# Altium project TEBF0808.PrjPCB (part 6 of 6)
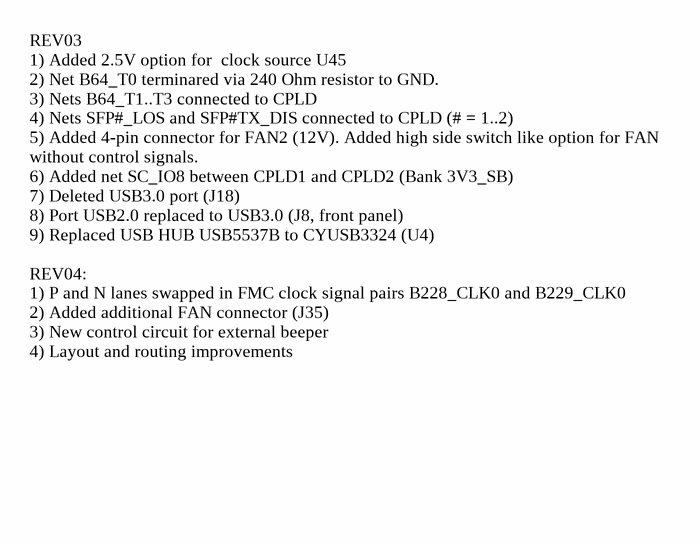
[diagram p36: Revision_Changes.SchDoc]

## Nets that join several sheets
1.2V: USB (20 pins), Power_3 (6 pins)
1.8V: USB-PHY (5 pins), ETH-PHY (9 pins), I2C_system (13 pins), CLK (L18.1), SD (C43.1 U15.5), SC (U17.37 U17.51 U17.66), SC2 (6 pins), XMOD (J12.6), J2 (D16.1), J3 (J3.43 J3.44), Audio (5 pins), eMMC (20 pins), Power_3 (11 pins)
3.3V_MOD: Power_1 (7 pins), J1 (5 pins), J2 (12 pins), J3 (5 pins)
3.3V_PCI: PCIe (6 pins), SFP (24 pins), Power_1 (7 pins)
3.3V_PER: TEBF0808 (R29.2), SFP (5 pins), DP_PS (C193.1 R38.1 R158.1 U40.8), USB-CONN (8 pins), USB (13 pins), USB-PHY (C21.1 L4.1 U9.20 U9.21), ETH-PHY (5 pins), I2C_system (R63.1 R132.1), CLK (L10.2 R130.1 R131.1), SD (6 pins), SC (U32.14), SC2 (5 pins), USB3-HUB (7 pins), FMC PWR (5 pins), MISC (12 pins), eMMC (9 pins), FireFly (16 pins), Power_3 (13 pins), CLK_MUX (6 pins), FMC_MISC (5 pins), PMODE (11 pins)
3V3SB: TEBF0808 (R109.1 R199.2), SC (17 pins), SC2 (15 pins), XMOD (J12.5 J28.5 J28.6 J30.1), Power_2 (R81.1 R183.1), Power_4 (6 pins)
5V: TEBF0808 (J10.9), DP_PS (U31.1 U31.2 U31.4), USB-CONN (C39.1 C82.1 U14.7 U21.7), USB-PHY (R65.1), USB3-HUB (R80.1 R83.2), Power_2 (13 pins), FMC PWR (Q3.4 R205.2), Audio (5 pins), MISC (J29.5), Power_3 (5 pins), Power_4 (D13.2)
12V: TEBF0808 (8 pins), PCIe (5 pins), Power_1 (8 pins), Power_2 (5 pins), FMC PWR (J5.C35 J5.C37), Power_3 (C174.2 C184.2 C186.1 U29.1)
FMC_VADJ: SC (U32.13), J1 (J1.90 J1.120), J3 (J3.15 J3.16), J4 (J4.58 J4.69 J4.105 J4.106), Power_2 (10 pins), FMC PWR (J5.E39 J5.F40 J5.G39 J5.H40), PMODE (U33.14)
GND: TEBF0808 (27 pins), PCIe (68 pins), SFP (31 pins), DP_PS (25 pins), USB-CONN (27 pins), USB (25 pins), USB-PHY (10 pins), ETH-PHY (24 pins), I2C_system (8 pins), CLK (20 pins), SD (20 pins), SC (21 pins), SC2 (20 pins), XMOD (13 pins), Power_1 (26 pins), J1 (50 pins), J2 (48 pins), J3 (30 pins), J4 (45 pins), USB3-HUB (15 pins), Power_2 (26 pins), FMC PWR (168 pins), Audio (29 pins), MISC (28 pins), eMMC (19 pins), FireFly (49 pins), Power_3 (33 pins), Power_4 (8 pins), CLK_MUX (11 pins), FMC_MISC (J5.C34 J5.D35 R125.1), PMODE (8 pins), SATA (5 pins)
1.8V_EN: SC2 (U39.106), Power_3 (R164.2 U19.27)
5V_EN: SC2 (U39.115), Power_2 (D15.1)
5VSBIN: TEBF0808 (J20.9), Power_4 (D12.2)
A_I2C_SCL: I2C_system (U27.4), Audio (R5.1 U3.32)
A_I2C_SDA: I2C_system (U27.3), Audio (R4.1 U3.31)
ADC_SDATA: J3 (J3.55), Audio (U3.26)
B47_L5_N: J3 (J3.54), CLK_MUX (R180.2 U45.4)
B47_L5_P: J3 (J3.56), CLK_MUX (R180.1 U45.5)
B48_L1_N: J3 (J3.17), FMC (J5.F31)
B48_L1_P: J3 (J3.19), FMC (J5.F32)
B48_L2_N: J3 (J3.21), FMC (J5.K35)
B48_L2_P: J3 (J3.23), FMC (J5.K34)
B48_L3_N: J3 (J3.7), FMC (J5.J34)
B48_L3_P: J3 (J3.9), FMC (J5.J33)
B48_L4_N: J3 (J3.11), FMC (J5.E34)
B48_L4_P: J3 (J3.13), FMC (J5.E33)
B48_L5_N: J3 (J3.25), FMC (J5.E31)
B48_L5_P: J3 (J3.27), FMC (J5.E30)
B48_L6_N: J3 (J3.3), FMC_MISC (J5.G3)
B48_L6_P: J3 (J3.5), FMC_MISC (J5.G2)
B48_L8_N: J3 (J3.4), FMC (J5.K38)
B48_L8_P: J3 (J3.6), FMC (J5.K37)
B48_L9_N: J3 (J3.8), FMC (J5.F35)
B48_L9_P: J3 (J3.10), FMC (J5.F34)
B48_L10_N: J3 (J3.22), FMC (J5.E37)
B48_L10_P: J3 (J3.24), FMC (J5.E36)
B48_L11_N: J3 (J3.26), FMC (J5.J37)
B48_L11_P: J3 (J3.28), FMC (J5.J36)
B48_L12_N: J3 (J3.12), FMC (J5.F38)
B48_L12_P: J3 (J3.14), FMC (J5.F37)
B64_L1_N: J4 (J4.138), FMC (J5.C11)
B64_L1_P: J4 (J4.140), FMC (J5.C10)
B64_L2_N: J4 (J4.132), FMC (J5.H11)
B64_L2_P: J4 (J4.134), FMC (J5.H10)
B64_L3_N: J4 (J4.120), FMC (J5.D12)
B64_L3_P: J4 (J4.122), FMC (J5.D11)
B64_L4_N: J4 (J4.116), FMC (J5.G12)
B64_L4_P: J4 (J4.114), FMC (J5.G13)
B64_L5_N: J4 (J4.104), FMC (J5.C14)
B64_L5_P: J4 (J4.102), FMC (J5.C15)
B64_L6_N: J4 (J4.96), FMC (J5.D15)
B64_L6_P: J4 (J4.98), FMC (J5.D14)
B64_L7_N: J4 (J4.152), FMC (J5.H7)
B64_L7_P: J4 (J4.150), FMC (J5.H8)
B64_L8_N: J4 (J4.144), FMC (J5.G10)
B64_L8_P: J4 (J4.146), FMC (J5.G9)
B64_L9_N: J4 (J4.108), FMC (J5.H14)
B64_L9_P: J4 (J4.110), FMC (J5.H13)
B64_L10_N: J4 (J4.90), FMC (J5.H17)
B64_L10_P: J4 (J4.92), FMC (J5.H16)
B64_L11_N: J4 (J4.80), FMC (J5.D9)
B64_L11_P: J4 (J4.78), FMC (J5.D8)
B64_L12_N: J4 (J4.126), FMC (J5.G7)
B64_L12_P: J4 (J4.128), FMC (J5.G6)
B64_L13_N: J4 (J4.66), FMC (J5.K26)
B64_L13_P: J4 (J4.68), FMC (J5.K25)
B64_L14_N: J4 (J4.72), FMC_MISC (J5.H5)
B64_L14_P: J4 (J4.74), FMC_MISC (J5.H4)
B64_L15_N: J4 (J4.38), FMC (J5.H19)
B64_L15_P: J4 (J4.36), FMC (J5.H20)
B64_L16_N: J4 (J4.84), FMC (J5.G16)
B64_L16_P: J4 (J4.86), FMC (J5.G15)
B64_L17_N: J4 (J4.62), FMC (J5.C18)
B64_L17_P: J4 (J4.60), FMC (J5.C19)
B64_L18_N: J4 (J4.56), FMC (J5.D17)
B64_L18_P: J4 (J4.54), FMC (J5.D18)
B64_L19_N: J4 (J4.30), FMC (J5.G19)
B64_L19_P: J4 (J4.32), FMC (J5.G18)
B64_L20_N: J4 (J4.48), FMC (J5.E22)
B64_L20_P: J4 (J4.50), FMC (J5.E21)
B64_L21_N: J4 (J4.44), FMC (J5.E24)
B64_L21_P: J4 (J4.42), FMC (J5.E25)
B64_L22_N: J4 (J4.20), FMC (J5.F22)
B64_L22_P: J4 (J4.18), FMC (J5.F23)
B64_L23_N: J4 (J4.26), FMC (J5.J25)
B64_L23_P: J4 (J4.24), FMC (J5.J24)
B64_L24_N: J4 (J4.12), FMC (J5.F26)
B64_L24_P: J4 (J4.14), FMC (J5.F25)
B64_T1: SC (U32.10), J4 (J4.6)
B64_T2: SC (U32.12), J4 (J4.2)
B64_T3: SC (U32.11), J4 (J4.4)
B65_L1_N: J4 (J4.145), FMC (J5.G37)
B65_L1_P: J4 (J4.143), FMC (J5.G36)
B65_L2_N: J4 (J4.125), FMC (J5.H23)
B65_L2_P: J4 (J4.127), FMC (J5.H22)
B65_L3_N: J4 (J4.137), FMC (J5.H34)
B65_L3_P: J4 (J4.139), FMC (J5.H35)
B65_L4_N: J4 (J4.107), FMC (J5.G27)
B65_L4_P: J4 (J4.109), FMC (J5.G28)
B65_L5_N: J4 (J4.151), FMC (J5.H38)
B65_L5_P: J4 (J4.149), FMC (J5.H37)
B65_L6_N: J4 (J4.83), FMC (J5.D27)
B65_L6_P: J4 (J4.85), FMC (J5.D26)
B65_L7_N: J4 (J4.71), FMC (J5.D24)
B65_L7_P: J4 (J4.73), FMC (J5.D23)
B65_L8_N: J4 (J4.121), FMC (J5.G31)
B65_L8_P: J4 (J4.119), FMC (J5.G30)
B65_L9_N: J4 (J4.101), FMC (J5.G22)
B65_L9_P: J4 (J4.103), FMC (J5.G21)
B65_L10_N: J4 (J4.95), FMC (J5.C27)
B65_L10_P: J4 (J4.97), FMC (J5.C26)
B65_L11_N: J4 (J4.77), FMC (J5.K29)
B65_L11_P: J4 (J4.79), FMC (J5.K28)
B65_L12_N: J4 (J4.65), FMC (J5.C23)
B65_L12_P: J4 (J4.67), FMC (J5.C22)
B65_L13_N: J4 (J4.91), FMC (J5.D21)
B65_L13_P: J4 (J4.89), FMC (J5.D20)
B65_L15_N: J4 (J4.59), FMC (J5.G25)
B65_L15_P: J4 (J4.61), FMC (J5.G24)
B65_L16_N: J4 (J4.133), FMC (J5.G34)
B65_L16_P: J4 (J4.131), FMC (J5.G33)
B65_L17_N: J4 (J4.17), FMC (J5.H29)
B65_L17_P: J4 (J4.19), FMC (J5.H28)
B65_L18_N: J4 (J4.55), FMC (J5.H25)
B65_L18_P: J4 (J4.53), FMC (J5.H26)
B65_L19_N: J4 (J4.49), FMC (J5.H31)
B65_L19_P: J4 (J4.47), FMC (J5.H32)
B65_L20_N: J4 (J4.35), FMC (J5.F29)
B65_L20_P: J4 (J4.37), FMC (J5.F28)
B65_L21_N: J4 (J4.31), FMC (J5.J27)
B65_L21_P: J4 (J4.29), FMC (J5.J28)
B65_L22_N: J4 (J4.25), FMC (J5.J30)
B65_L22_P: J4 (J4.23), FMC (J5.J31)
B65_L23_N: J4 (J4.41), FMC (J5.E28)
B65_L23_P: J4 (J4.43), FMC (J5.E27)
B65_L24_N: J4 (J4.13), FMC (J5.K31)
B65_L24_P: J4 (J4.11), FMC (J5.K32)
B65_T0: J4 (J4.7), PMODE (U33.4)
B65_T1: J4 (J4.5), PMODE (U33.3)
B65_T2: J4 (J4.3), PMODE (U33.2)
B65_T3: J4 (J4.1), PMODE (U33.1)
B66_L1_N: J1 (J1.140), FMC (J5.K23)
B66_L1_P: J1 (J1.142), FMC (J5.K22)
B66_L2_N: J1 (J1.99), FMC (J5.J12)
B66_L2_P: J1 (J1.101), FMC (J5.J13)
B66_L3_N: J1 (J1.93), FMC (J5.K10)
B66_L3_P: J1 (J1.95), FMC (J5.K11)
B66_L4_N: J1 (J1.87), FMC (J5.J9)
B66_L4_P: J1 (J1.89), FMC (J5.J10)
B66_L5_N: J1 (J1.83), FMC (J5.K8)
B66_L5_P: J1 (J1.81), FMC (J5.K7)
B66_L6_N: J1 (J1.77), FMC (J5.J7)
B66_L6_P: J1 (J1.75), FMC (J5.J6)
B66_L7_N: J1 (J1.100), FMC (J5.F8)
B66_L7_P: J1 (J1.98), FMC (J5.F7)
B66_L8_N: J1 (J1.130), FMC (J5.F17)
B66_L8_P: J1 (J1.128), FMC (J5.F16)
B66_L9_N: J1 (J1.76), FMC (J5.E7)
B66_L9_P: J1 (J1.74), FMC (J5.E6)
B66_L10_N: J1 (J1.135), FMC (J5.J21)
B66_L10_P: J1 (J1.137), FMC (J5.J22)
B66_L11_N: J1 (J1.92), FMC (J5.F5)
B66_L11_P: J1 (J1.94), FMC (J5.F4)
B66_L12_N: J1 (J1.116), FMC (J5.E13)
B66_L12_P: J1 (J1.118), FMC (J5.E12)
B66_L13_N: J1 (J1.88), FMC (J5.E3)
B66_L13_P: J1 (J1.86), FMC (J5.E2)
B66_L14_N: J1 (J1.146), FMC (J5.K17)
B66_L14_P: J1 (J1.148), FMC (J5.K16)
B66_L15_N: J1 (J1.136), FMC (J5.E19)
B66_L15_P: J1 (J1.134), FMC (J5.E18)
B66_L16_N: J1 (J1.122), FMC (J5.F13)
B66_L16_P: J1 (J1.124), FMC (J5.F14)
B66_L17_N: J1 (J1.107), FMC (J5.K14)
B66_L17_P: J1 (J1.105), FMC (J5.K13)
B66_L18_N: J1 (J1.131), FMC (J5.K20)
B66_L18_P: J1 (J1.129), FMC (J5.K19)
B66_L19_N: J1 (J1.123), FMC (J5.J18)
B66_L19_P: J1 (J1.125), FMC (J5.J19)
B66_L20_N: J1 (J1.111), FMC (J5.E15)
B66_L20_P: J1 (J1.113), FMC (J5.E16)
B66_L21_N: J1 (J1.104), FMC (J5.E9)
B66_L21_P: J1 (J1.106), FMC (J5.E10)
B66_L22_N: J1 (J1.117), FMC (J5.J15)
B66_L22_P: J1 (J1.119), FMC (J5.J16)
B66_L23_N: J1 (J1.110), FMC (J5.F10)
B66_L23_P: J1 (J1.112), FMC (J5.F11)
B66_L24_N: J1 (J1.80), FMC (J5.F19)
B66_L24_P: J1 (J1.82), FMC (J5.F20)
B66_T0: J1 (J1.147), PMODE (U33.5)
B66_T1: J1 (J1.145), PMODE (U33.16)
B66_T2: J1 (J1.143), PMODE (U33.15)
B66_T3: J1 (J1.141), PMODE (U33.6)
B128_RX0_N: J2 (J2.46), FireFly (J6.A15)
B128_RX0_P: J2 (J2.48), FireFly (J6.A14)
B128_RX1_N: J2 (J2.40), FireFly (J6.A18)
B128_RX1_P: J2 (J2.42), FireFly (J6.A17)
B128_RX2_N: J2 (J2.34), FireFly (J6.B15)
B128_RX2_P: J2 (J2.36), FireFly (J6.B14)
B128_RX3_N: J2 (J2.28), FireFly (J6.B18)
B128_RX3_P: J2 (J2.30), FireFly (J6.B17)
B128_TX0_N: J2 (J2.43), FireFly (J6.B3)
B128_TX0_P: J2 (J2.45), FireFly (J6.B2)
B128_TX1_N: J2 (J2.37), FireFly (J6.A3)
B128_TX1_P: J2 (J2.39), FireFly (J6.A2)
B128_TX2_N: J2 (J2.31), FireFly (J6.A6)
B128_TX2_P: J2 (J2.33), FireFly (J6.A5)
B128_TX3_N: J2 (J2.25), FireFly (J6.B6)
B128_TX3_P: J2 (J2.27), FireFly (J6.B5)
B228_CLK0_N: J3 (J3.60), FMC_MISC (C121.1)
B228_CLK0_P: J3 (J3.62), FMC_MISC (C122.1)
B228_RX0_N: J1 (J1.71), FMC (J5.C7)
B228_RX0_P: J1 (J1.69), FMC (J5.C6)
B228_RX1_N: J1 (J1.65), FMC (J5.A3)
B228_RX1_P: J1 (J1.63), FMC (J5.A2)
B228_RX2_N: J1 (J1.59), FMC (J5.A7)
B228_RX2_P: J1 (J1.57), FMC (J5.A6)
B228_RX3_N: J1 (J1.53), FMC (J5.A11)
B228_RX3_P: J1 (J1.51), FMC (J5.A10)
B228_TX0_N: J1 (J1.70), FMC (J5.C3)
B228_TX0_P: J1 (J1.68), FMC (J5.C2)
B228_TX1_N: J1 (J1.64), FMC (J5.A23)
B228_TX1_P: J1 (J1.62), FMC (J5.A22)
B228_TX2_N: J1 (J1.58), FMC (J5.A27)
B228_TX2_P: J1 (J1.56), FMC (J5.A26)
B228_TX3_N: J1 (J1.52), FMC (J5.A31)
B228_TX3_P: J1 (J1.50), FMC (J5.A30)
B229_CLK0_N: J3 (J3.65), FMC_MISC (C123.1)
B229_CLK0_P: J3 (J3.67), FMC_MISC (C124.1)
B229_RX0_N: J1 (J1.47), FMC (J5.A15)
B229_RX0_P: J1 (J1.45), FMC (J5.A14)
B229_RX1_N: J1 (J1.41), FMC (J5.A19)
B229_RX1_P: J1 (J1.39), FMC (J5.A18)
B229_RX2_N: J1 (J1.35), FMC (J5.B17)
B229_RX2_P: J1 (J1.33), FMC (J5.B16)
B229_RX3_N: J1 (J1.29), FMC (J5.B13)
B229_RX3_P: J1 (J1.27), FMC (J5.B12)
B229_TX0_N: J1 (J1.46), FMC (J5.A35)
B229_TX0_P: J1 (J1.44), FMC (J5.A34)
B229_TX1_N: J1 (J1.40), FMC (J5.A39)
B229_TX1_P: J1 (J1.38), FMC (J5.A38)
B229_TX2_N: J1 (J1.34), FMC (J5.B37)
B229_TX2_P: J1 (J1.32), FMC (J5.B36)
B229_TX3_N: J1 (J1.28), FMC (J5.B33)
B229_TX3_P: J1 (J1.26), FMC (J5.B32)
B230_CLK1_N: J3 (J3.59), CLK_MUX (C185.2)
B230_CLK1_P: J3 (J3.61), CLK_MUX (C179.2)
B230_RX0_N: J1 (J1.23), FMC (J5.B9)
B230_RX0_P: J1 (J1.21), FMC (J5.B8)
B230_RX1_N: J1 (J1.17), FMC (J5.B5)
B230_RX1_P: J1 (J1.15), FMC (J5.B4)
B230_RX2_N: SFP (J14.L12), J1 (J1.11)
B230_RX2_P: SFP (J14.L13), J1 (J1.9)
B230_RX3_N: SFP (J14.T12), J1 (J1.5)
B230_RX3_P: SFP (J14.T13), J1 (J1.3)
B230_TX0_N: J1 (J1.22), FMC (J5.B29)
B230_TX0_P: J1 (J1.20), FMC (J5.B28)
B230_TX1_N: J1 (J1.16), FMC (J5.B25)
B230_TX1_P: J1 (J1.14), FMC (J5.B24)
B230_TX2_N: SFP (J14.L19), J1 (J1.10)
B230_TX2_P: SFP (J14.L18), J1 (J1.8)
B230_TX3_N: SFP (J14.T19), J1 (J1.4)
B230_TX3_P: SFP (J14.T18), J1 (J1.2)
B505_CLK0_N: J2 (J2.12), CLK_MUX (C223.2)
B505_CLK0_P: J2 (J2.10), CLK_MUX (C182.2)
B505_CLK1_N: J2 (J2.18), CLK_MUX (C222.2)
B505_CLK1_P: J2 (J2.16), CLK_MUX (C221.2)
BCLK: J3 (J3.51), Audio (U3.28)
BEEPER: TEBF0808 (R169.2 T1.1), SC2 (R189.2)
C_TCK: SC (U17.131), SC2 (U39.131), XMOD (J28.4)
C_TDI: SC (U17.136), XMOD (J28.10)
C_TDO: SC2 (U39.137), XMOD (J28.8)
C_TDO1: SC (U17.137), SC2 (U39.136)
C_TMS: SC (U17.130), SC2 (U39.130), XMOD (J28.12)
CAN_FAULT: SC (U17.106), MISC (U30.5)
CAN_RX: SC (U17.107), MISC (U30.4)
CAN_S: SC (U17.105), MISC (U30.8)
CAN_TX: SC (U17.104), MISC (U30.1)
CLK0_N: PCIe (C93.2), J2 (J2.1)
CLK0_P: PCIe (C94.2), J2 (J2.3)
CLK7_N: J2 (J2.15), CLK_MUX (C185.1 R146.2)
CLK7_P: J2 (J2.13), CLK_MUX (C179.1 R146.1)
CLK8_N: CLK (C135.1 R59.2), J2 (J2.9)
CLK8_P: CLK (C25.1 R59.1), J2 (J2.7)
CLK_125MHz: ETH-PHY (U12.9), SC (U17.70)
CLK_A: SC2 (U39.1), Audio (R128.1)
CON_NTRST: SC (U17.117), XMOD (J30.3)
CON_RTCK: SC (U17.125), XMOD (J30.11)
CON_sRST: SC (U17.127), XMOD (J30.15)
CON_TCK: SC (U17.122), XMOD (J30.9)
CON_TDI: SC (U17.119), XMOD (J30.5)
CON_TDO: SC (U17.126), XMOD (J30.13)
CON_TMS: SC (U17.121), XMOD (J30.7)
DAC_SDATA: J3 (J3.53), Audio (U3.27)
DONE: SC2 (U39.67), J2 (J2.116)
DP0_TX_N: DP_PS (C140.1), J2 (J2.49)
DP0_TX_P: DP_PS (C139.1), J2 (J2.51)
DP_AUX_DE: DP_PS (U40.2 U40.3), SC (U17.92)
DP_AUX_RX: DP_PS (U40.1), SC (U17.91)
DP_AUX_TX: DP_PS (U40.4), SC (U17.93)
DP_EN: DP_PS (U31.5), SC (U17.77)
DP_TX_HPD: DP_PS (R40.1 R41.2), SC (U17.94)
EN_DDR: SC2 (U39.86), J2 (J2.112)
EN_FMC: SC2 (U39.104), Power_2 (R162.2 U8.41)
EN_FPD: SC2 (U39.81), J2 (J2.102)
EN_GT_L: SC2 (U39.77), J2 (J2.79)
EN_GT_R: SC2 (U39.93), J2 (J2.95)
EN_LPD: SC2 (U39.84), J2 (J2.108)
EN_PL: SC2 (U39.95), J2 (J2.101)
EN_PLL_PWR: SC2 (U39.78), J2 (J2.77)
EN_PSGT: SC2 (U39.75), J2 (J2.84)
ERR_OUT: SC2 (U39.70), J2 (J2.88)
ERR_STATUS: SC2 (U39.69), J2 (J2.86)
ETH_MDC: ETH-PHY (U12.7), J3 (J3.143)
ETH_MDIO: ETH-PHY (R14.2 U12.8), J3 (J3.144)
ETH_RST: ETH-PHY (U12.16), SC (U17.62)
ETH_RXCK: ETH-PHY (U12.46), J3 (J3.132)
ETH_RXCTL: ETH-PHY (U12.43), J3 (J3.142)
ETH_RXD0: ETH-PHY (U12.44), J3 (J3.134)
ETH_RXD1: ETH-PHY (U12.45), J3 (J3.136)
ETH_RXD2: ETH-PHY (U12.47), J3 (J3.138)
ETH_RXD3: ETH-PHY (U12.48), J3 (J3.140)
ETH_TXCK: ETH-PHY (U12.53), J3 (J3.131)
ETH_TXCTL: ETH-PHY (U12.56), J3 (J3.141)
ETH_TXD0: ETH-PHY (U12.50), J3 (J3.133)
ETH_TXD1: ETH-PHY (U12.51), J3 (J3.135)
ETH_TXD2: ETH-PHY (U12.54), J3 (J3.137)
ETH_TXD3: ETH-PHY (U12.55), J3 (J3.139)
EX_IO1: SC (U17.112), PMODE (P2.1)
EX_IO2: SC (U17.113), PMODE (P2.2)
EX_IO3: SC (U17.114), PMODE (P2.3)
EX_IO4: SC (U17.115), PMODE (P2.4)
EXT_SCL: I2C_system (U27.17), PMODE (P3.3 P3.9 R167.2)
EXT_SDA: I2C_system (U27.16), PMODE (P3.4 P3.10 R166.2)
F1PWM: TEBF0808 (R28.1), SC2 (U39.121)
F1SENSE: TEBF0808 (R27.1 R98.1), SC2 (U39.125)
F2_EN: TEBF0808 (U48.3), SC (U17.19)
F2PWM: TEBF0808 (R197.1), SC (U17.20)
F2SENSE: TEBF0808 (R196.1 R198.1), SC (U17.21)
FAN_FMC_EN: SC2 (U39.132), FMC PWR (Q3.5 R204.1)
FF_E_SCL: I2C_system (U27.15), FireFly (R149.2 U34.14)
FF_E_SDA: I2C_system (U27.14), FireFly (R148.2 U34.15)
FFA_SCL: I2C_system (J34.3 U27.6), FireFly (J15.8 R17.2)
FFA_SDA: I2C_system (J34.1 U27.5), FireFly (J15.7 R33.2)
FFB_SCL: I2C_system (U27.8), FireFly (J22.8 R46.2)
FFB_SDA: I2C_system (U27.7), FireFly (J22.7 R50.2)
FMC_CLK_DIR: SC (U17.73), FMC_MISC (J5.B1 R125.2)
FMC_PG_C2M: SC2 (U39.141), FMC_MISC (J5.D1 R129.2)
FMC_PG_M2C: SC2 (U38.6), FMC_MISC (J5.F1 R126.1)
FMC_PRSNT_M2C: SC2 (U38.7), FMC_MISC (J5.H2)
FMC_SCL: I2C_system (U16.15), FMC_MISC (J5.C30 R116.1)
FMC_SDA: I2C_system (U16.14), FMC_MISC (J5.C31 R62.1)
FMC_TCK: SC (U17.95), FMC_MISC (J5.D29)
FMC_TDI: SC (U17.96), FMC_MISC (J5.D30)
FMC_TDO: SC (U17.97), FMC_MISC (J5.D31)
FMC_TMS: SC (U17.98), FMC_MISC (J5.D33)
FMC_VID0: SC (U17.139), Power_2 (R186.1 U8.34)
FMC_VID1: SC (U17.140), Power_2 (R183.2 U8.33)
FMC_VID2: SC (U17.141), Power_2 (R185.1 U8.32)
FMCCLK2_N: CLK (U35.14), FMC_MISC (J5.K5)
FMCCLK2_P: CLK (U35.13), FMC_MISC (J5.K4)
FMCCLK3_N: CLK (U35.10), FMC_MISC (J5.J3)
FMCCLK3_P: CLK (U35.9), FMC_MISC (J5.J2)
HD_LED_N: TEBF0808 (J10.3), SC2 (U39.112)
HD_LED_P: TEBF0808 (R61.1), SC2 (U39.110)
HDIO_SC0: SC2 (U39.32), J3 (J3.31)
HDIO_SC1: SC2 (U39.33), J3 (J3.33)
HDIO_SC2: SC2 (U39.34), J3 (J3.35)
HDIO_SC3: SC2 (U39.35), J3 (J3.37)
HDIO_SC4: SC2 (U39.25), J3 (J3.39)
HDIO_SC5: SC2 (U39.26), J3 (J3.41)
HDIO_SC6: SC2 (U39.27), J3 (J3.45)
HDIO_SC7: SC2 (U39.28), J3 (J3.47)
HDIO_SC10: SC (U17.60), J3 (J3.32)
HDIO_SC11: SC (U17.59), J3 (J3.34)
HDIO_SC12: SC (U17.58), J3 (J3.36)
HDIO_SC13: SC (U17.57), J3 (J3.38)
HDIO_SC14: SC (U17.56), J3 (J3.40)
HDIO_SC15: SC (U17.55), J3 (J3.42)
HDIO_SC16: SC (U17.54), J3 (J3.46)
HDIO_SC17: SC (U17.52), J3 (J3.48)
HDIO_SC18: SC (U17.68), J3 (J3.50)
HDIO_SC19: SC (U17.69), J3 (J3.52)
I2C_RST: I2C_system (U16.24 U27.24), SC (U17.61)
I2C_SCL: I2C_system (R141.2 U16.19 U27.19), SC2 (U39.50), J3 (J3.102)
I2C_SDA: I2C_system (R142.2 U16.20 U27.20), SC2 (U39.52), J3 (J3.104)
IN2_N: CLK (C178.2), J3 (J3.68)
IN2_P: CLK (C176.1), J3 (J3.66)
INIT_B: SC2 (U39.68), J2 (J2.98)
JTAGENB: SC (U17.120), SC2 (R88.2 S4.3 U39.120)
LED_1A: ETH-PHY (J7.12), SC (U17.109)
LED_2A: ETH-PHY (J7.14), SC (U17.111)
LED_2B: ETH-PHY (R37.2), SC (U17.110)
LP_GOOD: SC2 (U39.83), J2 (J2.106)
LRCLK: J3 (J3.49), Audio (U3.29)
MCLK_SCL: I2C_system (U16.2), CLK (R130.2 U35.12), CLK_MUX (U45.8)
MCLK_SDA: I2C_system (U16.1), CLK (R131.2 U35.19), CLK_MUX (U45.7)
MEM_SCL: I2C_system (U16.13), SC2 (U38.14), MISC (5 pins)
MEM_SDA: I2C_system (U16.12), SC2 (U38.15), MISC (5 pins)
MIO24: SC2 (U39.38), J3 (J3.81)
MIO25: SC2 (U39.39), J3 (J3.83)
MIO26: SC (U17.41), J3 (J3.88)
MIO27: SC (U17.40), J3 (J3.90)
MIO28: SC (U17.39), J3 (J3.92)
MIO29: SC (U17.38), J3 (J3.94)
MIO30: SC2 (U39.48), J3 (J3.96)
MIO31: SC2 (U39.49), J3 (J3.98)
MIO32: SC2 (U39.40), J3 (J3.87)
MIO33: SC2 (U39.41), J3 (J3.89)
MIO34: SC2 (U39.42), J3 (J3.91)
MIO35: SC2 (U39.43), J3 (J3.93)
MIO36: SC2 (U39.44), J3 (J3.95)
MIO37: SC2 (U39.45), J3 (J3.97)
MIO40: SC2 (U39.54), J3 (J3.106)
MIO41: SC2 (U39.55), J3 (J3.108)
MIO42: SC2 (U39.60), J3 (J3.110)
MIO43: SC2 (U39.61), J3 (J3.112)
MIO44: SC2 (U39.47), J3 (J3.101)
MMC-CLKR: J3 (J3.77), eMMC (R103.1)
MMC-CMD: J3 (J3.75), eMMC (5 pins)
MMC-D0: J3 (J3.72), eMMC (R90.2 U2.H3)
MMC-D1: J3 (J3.74), eMMC (R91.2 U2.H4)
MMC-D2: J3 (J3.76), eMMC (R92.2 U2.H5)
MMC-D3: J3 (J3.78), eMMC (R93.2 U2.H1 U2.J2)
MMC-D4: J3 (J3.80), eMMC (R94.2 U2.H2 U2.J3)
MMC-D5: J3 (J3.82), eMMC (5 pins)
MMC-D6: J3 (J3.71), eMMC (6 pins)
MMC-D7: J3 (J3.73), eMMC (R99.2 U2.H8 U2.J6 U2.J7)
MMC_RST: J3 (J3.79), eMMC (R184.2 U2.U5)
MOD_EN: SC2 (U39.119), Power_1 (R153.2 R154.2)
MODE0: SC2 (U39.6), J2 (J2.109)
MODE1: SC2 (U39.9), J2 (J2.107)
MODE2: SC2 (U39.10), J2 (J2.105)
MODE3: SC2 (U39.11), J2 (J2.103)
MR: SC2 (U39.92), J2 (J2.83)
OCLK_EN: SC (U17.74), CLK_MUX (R181.1 R182.1)
PCI_RX_N: PCIe (J11.A17), J2 (J2.70)
PCI_RX_P: PCIe (J11.A16), J2 (J2.72)
PCI_SFP_EN: SC2 (U39.76), Power_1 (R155.2 R157.2)
PCI_TX_N: PCIe (C70.2), J2 (J2.67)
PCI_TX_P: PCIe (C69.2), J2 (J2.69)
PCIe_SCL: PCIe (J11.B5 R120.2), I2C_system (U16.6)
PCIe_SDA: PCIe (J11.B6 R119.2), I2C_system (U16.5)
PER_EN: SC2 (U39.117), Power_3 (R156.2 R163.2)
PERST: PCIe (J11.A11), SC2 (U39.139)
PG_DDR: SC2 (U39.91), J2 (J2.114)
PG_FPD: SC2 (U39.85), J2 (J2.110)
PG_GT_L: SC2 (U39.96), J2 (J2.97)
PG_GT_R: SC2 (U39.94), J2 (J2.91)
PG_PL: SC2 (U39.82), J2 (J2.104)
PG_PLL_1V8: SC2 (U39.73), J2 (J2.80)
PG_PSGT: SC2 (U39.74), J2 (J2.82)
PHY_CONFIG: ETH-PHY (U12.15), SC (U17.65)
PHY_LED0: ETH-PHY (U12.14), SC (U17.67)
PHY_LED1: ETH-PHY (U12.13), SC (U17.86)
PHY_LED2: ETH-PHY (U12.12), SC (U17.85)
PLL_LOLn: SC2 (U39.58), J2 (J2.85)
PLL_RST: SC2 (U39.56), J2 (J2.89)
PLL_SCL: I2C_system (R136.1 U27.11), J2 (J2.90), MISC (J17.3)
PLL_SDA: I2C_system (R135.1 U27.10), J2 (J2.92), MISC (J17.7)
PLL_SEL0: SC2 (U39.57), J2 (J2.93)
PLL_SEL1: SC2 (U39.59), J2 (J2.87)
PMOD_SCL: I2C_system (U27.2), PMODE (P1.3 P1.9 R144.2)
PMOD_SDA: I2C_system (U27.1), PMODE (P1.4 P1.10 R140.2)
POK_1V8: SC2 (U39.107), Power_3 (U19.28)
POK_FMC: SC2 (U39.99), Power_2 (R81.2 U8.35)
PROG_B: SC2 (U39.71), J2 (J2.100)
PRSNT1: PCIe (J11.A1), SC2 (U38.5)
PRSNT2: PCIe (J11.B17), SC2 (U38.9)
PRSNT3: PCIe (J11.B31), SC2 (U38.10)
PRSNT4: PCIe (J11.B48), SC2 (U38.11)
PRSNT5: PCIe (J11.B81), SC2 (U38.12)
PSON: TEBF0808 (J20.16), SC2 (U39.105)
PUDC_B: J2 (J2.127), MISC (S4.8)
PWR_BTN: TEBF0808 (J10.6 S1.2), SC2 (U39.113)
PWRLED_N: TEBF0808 (J10.4), SC2 (U39.111)
PWRLED_P: TEBF0808 (R60.1), SC2 (U39.109)
PWROK: TEBF0808 (J20.8), SC2 (U39.100)
RST_BTN: TEBF0808 (J10.7 S2.2), SC2 (U39.114)
SATA_RX_N: J2 (J2.58), SATA (C202.1)
SATA_RX_P: J2 (J2.60), SATA (C203.1)
SATA_TX_N: J2 (J2.55), SATA (C200.1)
SATA_TX_P: J2 (J2.57), SATA (C197.1)
SC2_SW1: SC2 (U39.133), MISC (S5.8)
SC2_SW2: SC2 (U39.138), MISC (S5.7)
SC2_SW3: SC (U17.6), MISC (S5.6)
SC2_SW4: SC (U17.5), MISC (S5.5)
SC_CLK0: CLK (U35.22), SC (U17.76)
SC_CLK1: CLK (U35.17), SC (U17.75)
SC_IO0: SC (U17.50), SC2 (U39.12)
SC_IO1: SC (U17.49), SC2 (U39.13)
SC_IO2: SC (U17.48), SC2 (U39.14)
SC_IO3: SC (U17.47), SC2 (U39.20)
SC_IO4: SC (U17.45), SC2 (U39.21)
SC_IO5: SC (U17.44), SC2 (U39.22)
SC_IO6: SC (U17.43), SC2 (U39.23)
SC_IO7: SC (U17.42), SC2 (U39.24)
SC_IO8: SC (U17.22), SC2 (U39.126)
SC_SCL: I2C_system (R132.2 U27.13), SC (U17.14)
SC_SDA: I2C_system (R63.2 U27.12), SC (U17.13)
SD_A_EN: SD (Q1.5 R137.1), SC2 (U39.140)
SD_B_EN: SD (Q2.5 R139.1), SC2 (U39.122)
SD_CD: SC2 (U39.65), J3 (J3.103)
SD_CD_B: SD (J27.10), SC2 (U39.143)
SD_CD_S: SD (J16.9), SC2 (U39.142)
SD_CLK: SD (U15.9), J3 (J3.114)
SD_CMD: SD (U15.4), J3 (J3.113)
SD_DAT0: SD (U15.6), J3 (J3.105)
SD_DAT1: SD (U15.7), J3 (J3.107)
SD_DAT2: SD (U15.1), J3 (J3.109)
SD_DAT3: SD (U15.3), J3 (J3.111)
SD_WP: SD (J27.11), SC (U17.100)
SEL_SD: SD (U15.24), SC2 (U39.62)
SFP1_LOS: SFP (J14.T8 R113.1), SC (U17.32)
SFP1_SCL: SFP (J14.T5 R21.1), I2C_system (U16.8)
SFP1_SDA: SFP (J14.T4 R18.1), I2C_system (U16.7)
SFP1_TX_DIS: SFP (J14.T3 R107.1), SC (U17.33)
SFP2_LOS: SFP (J14.L8 R123.1), SC (U17.35)
SFP2_SCL: SFP (J14.L5 R121.1), I2C_system (U16.11)
SFP2_SDA: SFP (J14.L4 R115.1), I2C_system (U16.10)
SFP2_TX_DIS: SFP (J14.L3 R118.1), SC (U17.34)
SFP_LED1: SFP (R101.1), SC (U17.81)
SFP_LED2: SFP (R102.1), SC (U17.82)
SFP_LED3: SFP (R104.1), SC (U17.78)
SFP_LED4: SFP (R105.1), SC (U17.83)
SFP_SCL: SFP (R165.2 U44.14), I2C_system (U16.4)
SFP_SDA: SFP (R179.2 U44.15), I2C_system (U16.3)
SRST_B: SC2 (U39.19), J2 (J2.96)
STAT_LED0: SC (U17.99), MISC (R72.1)
STAT_LED1: SC (U17.128), MISC (R73.1)
STAT_LED2: SC2 (U39.98), MISC (R74.1)
STAT_LED3: SC2 (U39.97), MISC (R75.1)
TCK: XMOD (J12.4), J2 (J2.120)
TDI: XMOD (J12.10), J2 (J2.122)
TDO: XMOD (J12.8), J2 (J2.124)
TMS: XMOD (J12.12), J2 (J2.126)
USB0_CLK: USB-PHY (R7.2), J3 (J3.118)
USB0_D_N: USB-PHY (U9.19), USB3-HUB (U4.72)
USB0_D_P: USB-PHY (U9.18), USB3-HUB (U4.71)
USB0_DATA0: USB-PHY (U9.3), J3 (J3.126)
USB0_DATA1: USB-PHY (U9.4), J3 (J3.128)
USB0_DATA2: USB-PHY (U9.5), J3 (J3.122)
USB0_DATA3: USB-PHY (U9.6), J3 (J3.119)
USB0_DATA4: USB-PHY (U9.7), J3 (J3.121)
USB0_DATA5: USB-PHY (U9.9), J3 (J3.123)
USB0_DATA6: USB-PHY (U9.10), J3 (J3.125)
USB0_DATA7: USB-PHY (U9.13), J3 (J3.127)
USB0_DIR: USB-PHY (U9.31), J3 (J3.120)
USB0_NXT: USB-PHY (U9.2), J3 (J3.124)
USB0_RST: USB-PHY (U9.27), SC (U17.71)
USB0_STP: USB-PHY (U9.29), J3 (J3.117)
USB2_DN1_D_N: USB-CONN (J8.12), USB3-HUB (U4.73)
USB2_DN1_D_P: USB-CONN (J8.11), USB3-HUB (U4.74)
USB2_DN2_D_N: USB-CONN (J8.8), USB3-HUB (U4.77)
USB2_DN2_D_P: USB-CONN (J8.9), USB3-HUB (U4.76)
USB2_DN3_D_N: USB-CONN (J7.U11), USB3-HUB (U4.78)
USB2_DN3_D_P: USB-CONN (J7.U12), USB3-HUB (U4.79)
USB2_DN4_D_N: USB-CONN (J7.U2), USB3-HUB (U4.82)
USB2_DN4_D_P: USB-CONN (J7.U3), USB3-HUB (U4.81)
USB3_RXDN1_D_N: USB-CONN (J8.18 U51.5 U51.6), USB3-HUB (U4.60)
USB3_RXDN1_D_P: USB-CONN (J8.17 U51.4 U51.7), USB3-HUB (U4.61)
USB3_RXDN2_D_N: USB-CONN (J8.2 U49.1 U49.9), USB3-HUB (U4.55)
USB3_RXDN2_D_P: USB-CONN (J8.3 U49.2 U49.8), USB3-HUB (U4.54)
USB3_RXDN3_D_N: USB-CONN (J7.U14 U50.1 U50.9), USB3-HUB (U4.45)
USB3_RXDN3_D_P: USB-CONN (J7.U15 U50.2 U50.8), USB3-HUB (U4.46)
USB3_RXDN4_D_N: USB-CONN (J7.U5 U11.1 U11.9), USB3-HUB (U4.20)
USB3_RXDN4_D_P: USB-CONN (J7.U6 U11.2 U11.8), USB3-HUB (U4.19)
USB3_RXUP_N: J2 (J2.64), USB3-HUB (C152.1)
USB3_RXUP_P: J2 (J2.66), USB3-HUB (C155.1)
USB3_TXDN1_D_N: USB-CONN (C10.1), USB3-HUB (U4.57)
USB3_TXDN1_D_P: USB-CONN (C9.1), USB3-HUB (U4.58)
USB3_TXDN2_D_N: USB-CONN (C7.1), USB3-HUB (U4.52)
USB3_TXDN2_D_P: USB-CONN (C8.1), USB3-HUB (U4.51)
USB3_TXDN3_D_N: USB-CONN (C5.1), USB3-HUB (U4.48)
USB3_TXDN3_D_P: USB-CONN (C6.1), USB3-HUB (U4.49)
USB3_TXDN4_D_N: USB-CONN (C3.1), USB3-HUB (U4.17)
USB3_TXDN4_D_P: USB-CONN (C4.1), USB3-HUB (U4.16)
USB3_TXUP_N: J2 (J2.61), USB3-HUB (C150.1)
USB3_TXUP_P: J2 (J2.63), USB3-HUB (C151.1)
USBH_EN1: USB-CONN (R106.2 U14.1), USB3-HUB (U4.38)
USBH_EN2: USB-CONN (R110.2 U14.4), USB3-HUB (U4.86)
USBH_EN3: USB-CONN (R145.2 U21.4), USB3-HUB (U4.87)
USBH_EN4: USB-CONN (R111.2 U21.1), USB3-HUB (U4.35)
USBH_LED_G3: SC (U17.11), USB3-HUB (U4.64)
USBH_LED_G4: SC (U17.12), USB3-HUB (U4.43)
USBH_LED_SS1: SC (U17.9), USB3-HUB (U4.4)
USBH_LED_SS2: SC (U17.133), USB3-HUB (U4.84)
USBH_LED_SS3: SC (U17.132), USB3-HUB (R1.2 U4.63)
USBH_LED_SS4: SC (U17.138), USB3-HUB (R203.2 U4.26)
USBH_MODE0: SC (U17.142), USB3-HUB (U4.28)
USBH_MODE1: SC (U17.143), USB3-HUB (U4.29)
USBH_OC1: USB-CONN (R3.2 U14.2), USB3-HUB (U4.42)
USBH_OC2: USB-CONN (R64.2 U14.3), USB3-HUB (U4.1)
USBH_OC3: USB-CONN (R70.2 U21.3), USB3-HUB (U4.65)
USBH_OC4: USB-CONN (R69.2 U21.2), USB3-HUB (U4.36)
USBH_RST: SC (U17.10), USB3-HUB (U4.37)
USBH_SCL: I2C_system (U16.17), USB3-HUB (R71.1 U4.40 U5.6)
USBH_SDA: I2C_system (U16.16), USB3-HUB (R76.1 U4.41 U5.5)
VREF_A_M2C: J1 (R160.2), J4 (R32.2 R161.1), FMC PWR (J5.H1)
WAKE: PCIe (J11.B11), SC2 (U38.4)
XMOD1_A: SC (U17.3), XMOD (J28.3)
XMOD1_B: SC (U17.2), XMOD (J28.7)
XMOD1_E: SC (U17.4), XMOD (J28.9)
XMOD1_G: SC (U17.1), XMOD (J28.11)
XMOD2_A: SC2 (U39.5), XMOD (J12.3)
XMOD2_B: SC2 (U39.4), XMOD (J12.7)
XMOD2_E: SC2 (U39.3), XMOD (J12.9)
XMOD2_G: SC2 (U39.2), XMOD (J12.11)

## Assembly variants
TEBF0808: not fitted C55 C56 R20 R24 R79 R107 R108 R117 R118 R124 R127 R134 R146 R172 R177 R178 R182 R194 U6 U45 U48